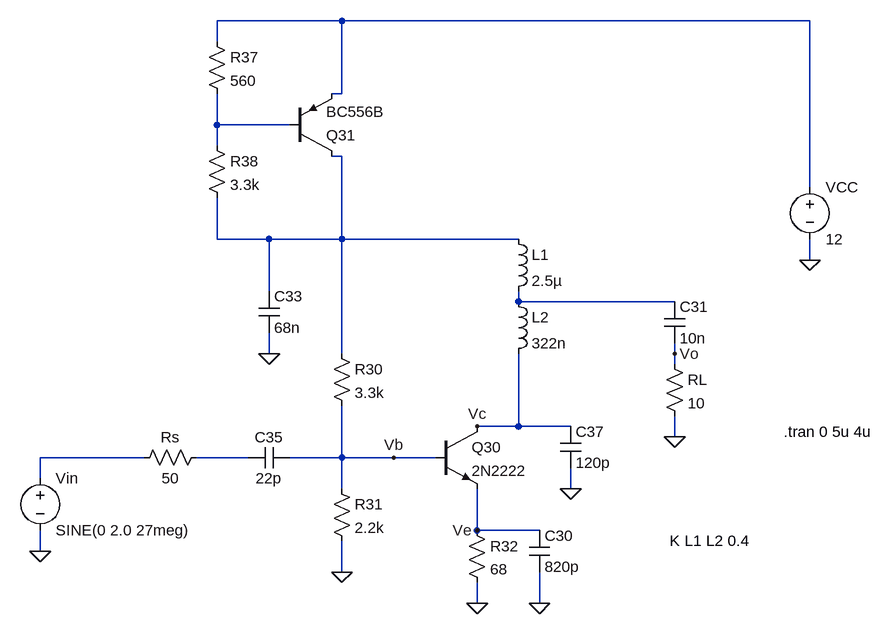
[diagram p0: schematic Transmitter Amplifier.asc]
Transmitter Amplifier.asc, the LTspice schematic file:
Version 4.1
SHEET 1 1328 680
WIRE 496 -576 304 -576
WIRE 1216 -576 496 -576
WIRE 304 -544 304 -576
WIRE 496 -464 496 -576
WIRE 496 -464 480 -464
WIRE 304 -416 304 -464
WIRE 416 -416 304 -416
WIRE 304 -384 304 -416
WIRE 496 -368 480 -368
WIRE 1216 -320 1216 -576
WIRE 304 -240 304 -304
WIRE 384 -240 304 -240
WIRE 496 -240 496 -368
WIRE 496 -240 384 -240
WIRE 768 -240 496 -240
WIRE 1216 -208 1216 -240
WIRE 384 -160 384 -240
WIRE 768 -144 768 -160
WIRE 1008 -144 768 -144
WIRE 384 -64 384 -96
WIRE 496 -64 496 -240
WIRE 1008 -64 1008 -80
WIRE 1008 -48 1008 -64
WIRE 768 48 768 -64
WIRE 768 48 704 48
WIRE 848 48 768 48
WIRE 1008 64 1008 32
WIRE 192 96 32 96
WIRE 352 96 272 96
WIRE 496 96 496 16
WIRE 496 96 416 96
WIRE 576 96 496 96
WIRE 640 96 576 96
WIRE 32 128 32 96
WIRE 496 144 496 96
WIRE 848 144 848 112
WIRE 704 208 704 144
WIRE 800 208 704 208
WIRE 32 240 32 208
WIRE 496 272 496 224
WIRE 704 320 704 288
WIRE 800 320 800 272
FLAG 32 240 0
FLAG 496 272 0
FLAG 384 -64 0
FLAG 848 144 0
FLAG 704 320 0
FLAG 800 320 0
FLAG 1008 64 0
FLAG 1216 -208 0
FLAG 576 96 Vb
FLAG 704 48 Vc
FLAG 704 208 Ve
FLAG 1008 -64 Vo
SYMBOL voltage 32 112 R0
WINDOW 123 0 0 Left 0
WINDOW 39 0 0 Left 0
SYMATTR InstName Vin
SYMATTR Value SINE(0 2.0 27meg)
SYMBOL res 288 80 R90
WINDOW 0 0 56 VBottom 2
WINDOW 3 32 56 VTop 2
SYMATTR InstName Rs
SYMATTR Value 50
SYMBOL cap 416 80 R90
WINDOW 0 0 32 VBottom 2
WINDOW 3 32 32 VTop 2
SYMATTR InstName C35
SYMATTR Value 22p
SYMBOL res 480 128 R0
SYMATTR InstName R31
SYMATTR Value 2.2k
SYMBOL res 480 -80 R0
SYMATTR InstName R30
SYMATTR Value 3.3k
SYMBOL cap 368 -160 R0
SYMATTR InstName C33
SYMATTR Value 68n
SYMBOL res 288 -400 R0
SYMATTR InstName R38
SYMATTR Value 3.3k
SYMBOL res 288 -560 R0
SYMATTR InstName R37
SYMATTR Value 560
SYMBOL pnp 416 -368 M180
SYMATTR InstName Q31
SYMATTR Value BC556B
SYMBOL ind 752 -256 R0
SYMATTR InstName L1
SYMATTR Value 2.5µ
SYMATTR Type ind
SYMBOL ind 752 -160 R0
SYMATTR InstName L2
SYMATTR Value 322n
SYMATTR Type ind
SYMBOL npn 640 48 R0
SYMATTR InstName Q30
SYMATTR Value 2N2222
SYMBOL cap 832 48 R0
SYMATTR InstName C37
SYMATTR Value 120p
SYMBOL res 688 192 R0
SYMATTR InstName R32
SYMATTR Value 68
SYMBOL cap 784 208 R0
SYMATTR InstName C30
SYMATTR Value 820p
SYMBOL cap 992 -144 R0
SYMATTR InstName C31
SYMATTR Value 10n
SYMBOL res 992 -64 R0
SYMATTR InstName RL
SYMATTR Value 10
SYMBOL voltage 1216 -336 R0
SYMATTR InstName VCC
SYMATTR Value 12
TEXT 1000 224 Left 2 !K L1 L2 0.4
TEXT 1176 56 Left 2 !.tran 0 5u 4u

The netlist it stands for:
* Transmitter Amplifier.asc
Vin N005 0 SINE(0 2.0 27meg)
Rs N006 N005 50
C35 Vb N006 22p
R31 Vb 0 2.2k
R30 N003 Vb 3.3k
C33 N003 0 68n
R38 N002 N003 3.3k
R37 N001 N002 560
Q31 N003 N002 N001 0 BC556B
L1 N003 N004 2.5µ
L2 N004 Vc 322n
Q30 Vc Vb Ve 0 2N2222
C37 Vc 0 120p
R32 Ve 0 68
C30 Ve 0 820p
C31 N004 Vo 10n
RL Vo 0 10
VCC N001 0 12
.model NPN NPN
.model PNP PNP
.lib standard.bjt
K L1 L2 0.4
.tran 0 5u 4u
.backanno
.end